# EAGLE design imu (EAGLE 9.3.2)
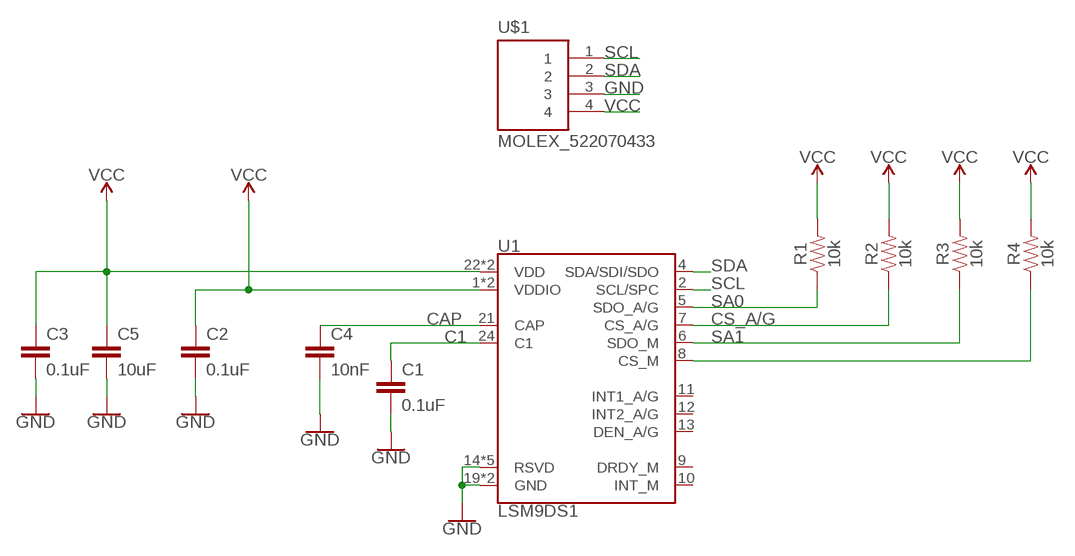
[diagram p0: schematic, sheet 1]

## Parts
C1  0.1uF  0.1UF-0603-25V-(+80/-20%)  [0603]
C2  0.1uF  0.1UF-0603-25V-(+80/-20%)  [0603]
C3  0.1uF  0.1UF-0603-25V-(+80/-20%)  [0603]
C4  10nF  10NF-0603-50V-10%  [0603]
C5  10uF  10UF-0603-6.3V-20%  [0603]
R1  10k  10KOHM-0603-1/10W-1%  [0603]
R2  10k  10KOHM-0603-1/10W-1%  [0603]
R3  10k  10KOHM-0603-1/10W-1%  [0603]
R4  10k  10KOHM-0603-1/10W-1%  [0603]
U1  LSM9DS1  [LGA-24-3.5X3]
U$1  MOLEX_522070433  [MOLEX4_1MM]

## Nets
C1: C1.1 U1.24(C1)
CAP: C4.1 U1.21(CAP)
CS_A/G: R2.1 U1.7(CS_A/G)
CS_M: R4.1 U1.8(CS_M)
GND: C1.2 C2.2 C3.2 C4.2 C5.2 U1.14(RSVD) U1.15(RSVD) U1.16(RSVD) U1.17(RSVD) U1.18(RSVD) U1.19(GND) U1.20(GND) U$1.3
SA0: R1.1 U1.5(SDO_A/G)
SA1: R3.1 U1.6(SDO_M)
SCL: U1.2(SCL/SPC) U$1.1
SDA: U1.4(SDA/SDI/SDO) U$1.2
VCC: C2.1 C3.1 C5.1 R1.2 R2.2 R3.2 R4.2 U1.1(VDDIO) U1.3(VDDIO) U1.22(VDD) U1.23(VDD) U$1.4
Unconnected: U1.9(DRDY_M) U1.10(INT_M) U1.11(INT1_A/G) U1.12(INT2_A/G) U1.13(DEN_A/G)

## Library data of the parts
C1-C3 = SparkFun-Capacitors:0.1UF: 0.1µF ceramic capacitors A capacitor is a passive two-terminal electrical component used to store electrical energy temporarily in an electric field.; PROD_ID: CAP-00810
C4 = SparkFun-Capacitors:10NF: 0.01uF/10nF/10,000pF ceramic capacitors A capacitor is a passive two-terminal electrical component used to store electrical energy temporarily in an electric field. CAP-09321; PROD_ID: CAP-00867
C5 = SparkFun-Capacitors:10UF: 10.0µF ceramic capacitors A capacitor is a passive two-terminal electrical component used to store electrical energy temporarily in an electric field.; PROD_ID: CAP-11015
R1-R4 = SparkFun-Resistors:10KOHM: 10kΩ resistor A resistor is a passive two-terminal electrical component that implements electrical resistance as a circuit element. Resistors act to reduce current flow, and, at the same time, act to lower voltage levels within circuits. - Wikipedia; PROD_ID: RES-00824
U1 = SparkFun-Sensors:LSM9DS1: ST Microelectronics LSM9DS1 9DOF IMU - Accelerometer, Gyroscope & Magnetometer The LSM9DS1 is a versatile, motion-sensing system-in-a-chip. It houses a 3-axis accelerometer, 3-axis gyroscope, and 3-axis magnetometer – nine degrees of freedom (9DOF) in a single IC! The LSM9DS1 is equipped with a digital interface, but even that is flexible: it supports both I2C and SPI, so you’ll be hard-pressed to find a microcontroller it doesn’t work with. Datasheet <https://cdn.sparkfun.com/assets/learn_tutorials/3/7/3/LSM9DS1_Datasheet.pdf> SparkFun Products SparkFun 9 Degrees of Freedom IMU Breakout - LSM9DS1 <https://www.sparkfun.com/products/13284> (SEN-13284) SparkFun Photon IMU Shield <https://www.sparkfun.com/products/13629> (DEV-13629); PROD_ID: IC-12536
U$1 = custom:MOLEX_522070433

## Board
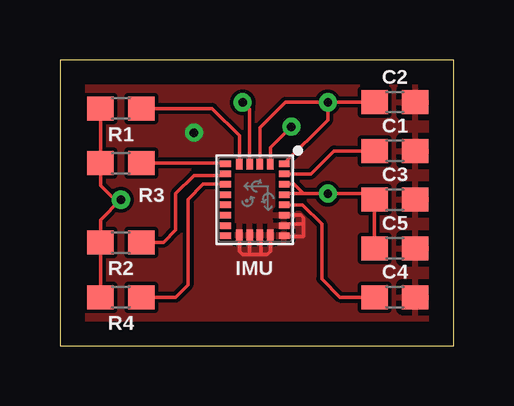
[diagram p1: board, top side]
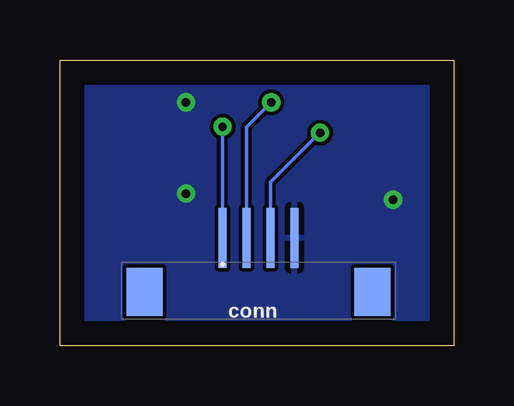
[diagram p2: board, bottom side, seen from below]

Size 16.43 x 11.93 mm. Coordinates in mm from the lower left corner, seen from the top.
Outline: 0,0 16.43,0 16.43,11.93 0,11.93 0,0
Copper layers (1*16): Top 0.035mm / dielectric 1.5mm / Bottom 0.035mm
Design rules "default": minimum track width 6mil, minimum drill 0.35mm, track to track 6mil, track to pad 6mil, pad to pad 6mil, via to via 6mil, smd to smd 6mil, copper to edge 40mil, drill to drill 6mil, minimum pad ring 10mil, minimum via ring 8mil, stop-mask expansion 4mil, vias tented up to drill 0mil, thermal gap 10mil

### Footprints (pad centres in the part's own frame; a part is rotated, then mirrored left to right if it is on the bottom)
0603 = smd 1.1 x 1: 1 -0.85,0; 2 0.85,0
LGA-24-3.5X3 = smd 0.27 x 0.45: 1 -1.505,1.225; 6 -1.505,-1.225; 7 -1.075,-1.225; 8 -0.645,-1.225; 9 -0.215,-1.225; 10 0.215,-1.225; 11 0.645,-1.225; 12 1.075,-1.225; 13 1.505,-1.225; 18 1.505,1.225; 19 1.075,1.225; 20 0.645,1.225; 21 0.215,1.225; 22 -0.215,1.225; 23 -0.645,1.225; 24 -1.075,1.225 | smd 0.45 x 0.27: 2 -1.475,0.645; 3 -1.475,0.215; 4 -1.475,-0.215; 5 -1.475,-0.645; 14 1.475,-0.645; 15 1.475,-0.215; 16 1.475,0.215; 17 1.475,0.645
MOLEX4_1MM = smd 0.32 x 2.5: 1 0,1.2; 2 1,1.2; 3 2,1.2; 4 3,1.2 | smd 1.5 x 2: P$5 6.25,-1.05; P$6 -3.25,-1.05

### Placement (x,y rotation side)
C1  13.97,8.13 0 top
C2  13.97,10.16 0 top
C3  13.97,6.1 0 top
C4  13.97,2.03 0 top
C5  13.97,4.06 0 top
R1  2.54,9.91 180 top
R2  2.54,4.32 180 top
R3  2.54,7.62 180 top
R4  2.54,2.03 180 top
U1  8.13,6.1 270 top
U$1  9.65,3.3 0 bottom

### Tracks (layer width: path | path; a pad name or v marks a point on that pad's centre or on a via)
C1
  Top 0.152: U1.24 10.47,7.17 11.43,8.13 C1.1
CAP
  Top 0.152: U1.21 10.12,5.88 10.92,5.08 10.92,2.79 11.68,2.03 C4.1
CS_A/G
  Top 0.152: U1.7 6.84,7.11 5.59,7.11 4.83,6.35 4.83,4.83 4.32,4.32 R2.1
CS_M
  Top 0.152: U1.8 5.98,6.74 5.33,6.1 5.33,2.54 4.83,2.03 R4.1
GND  (via drill 0.35)
  Top 0.152: U1.14 7.48,3.95 7.62,3.81 7.87,3.81 | 7.87,3.81 8.38,3.81 | 8.38,3.81 8.64,3.81 8.77,3.95 U1.17 | U1.16 8.38,4.58 8.38,3.81 | U1.15 7.91,3.85 7.87,3.81 | U1.20 10.04,5.45 10.16,5.33 10.16,5.08 | 10.16,5.08 10.16,4.57 9.37,4.57 U1.18 | U1.19 9.41,5.08 10.16,5.08
  Bottom 0.152: U$1.3 7.65,6.83 v5.59,8.89
  pour Top: 0.51,11.43 16,11.43 16,0.51 0.51,0.51
SA0
  Top 0.152: U1.5 7.48,8.77 6.35,9.91 R1.1
SA1
  Top 0.152: U1.6 6.88,7.62 R3.1
SCL  (via drill 0.35)
  Top 0.152: U1.2 8.77,8.26 v9.65,9.14
  Bottom 0.152: U$1.1 v9.65,9.14
SDA  (via drill 0.35)
  Top 0.152: U1.4 7.91,9.87 v7.62,10.16
  Bottom 0.152: v7.62,10.16 8.65,9.13 U$1.2
VCC  (via drill 0.35)
  Top 0.152: C5.1 C3.1 12.87,6.35 v11.18,6.35 10.16,6.35 | C2.1 v11.18,10.16 | U1.22 9.42,6.25 9.53,6.35 10.16,6.35 | U1.23 9.77,6.74 10.16,6.35 | U1.1 11.18,9.42 v11.18,10.16 | R4.2 R2.2 1.69,5.25 v2.54,6.1 2.29,6.1 1.69,6.69 R3.2 R1.2 | U1.3 8.34,9.11 9.4,10.16 v11.18,10.16
  pour Bottom: 0.51,11.43 16,11.43 16,0.51 0.51,0.51

### Text on the board
tPlace: IMU
bPlace: conn